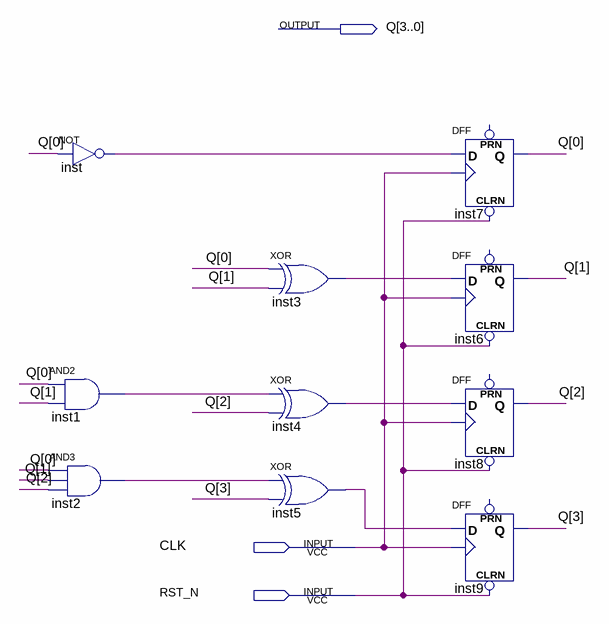
[diagram p0: schematic sheet]
// Quartus schematic cnt4.bdf as structural Verilog: 10 symbols, 3 pins
module cnt4 (
  input  CLK,
  input  RST_N,
  output [3:0] Q
);

  wire inst1_out, inst2_out, inst3_out, inst4_out, inst5_out, inst_out;

  and inst1 (inst1_out, Q[0], Q[1]);
  and inst2 (inst2_out, Q[0], Q[1], Q[2]);
  not inst (inst_out, Q[0]);
  xor inst3 (inst3_out, Q[0], Q[1]);
  xor inst4 (inst4_out, inst1_out, Q[2]);
  xor inst5 (inst5_out, inst2_out, Q[3]);
  DFF inst7 (.CLRN(RST_N), .CLK(CLK), .D(inst_out), .Q(Q[0]));  // open: PRN
  DFF inst6 (.CLRN(RST_N), .CLK(CLK), .D(inst3_out), .Q(Q[1]));  // open: PRN
  DFF inst8 (.CLRN(RST_N), .CLK(CLK), .D(inst4_out), .Q(Q[2]));  // open: PRN
  DFF inst9 (.CLRN(RST_N), .CLK(CLK), .D(inst5_out), .Q(Q[3]));  // open: PRN
endmodule
